# Altium schematic sheet LED.SchDoc
size A
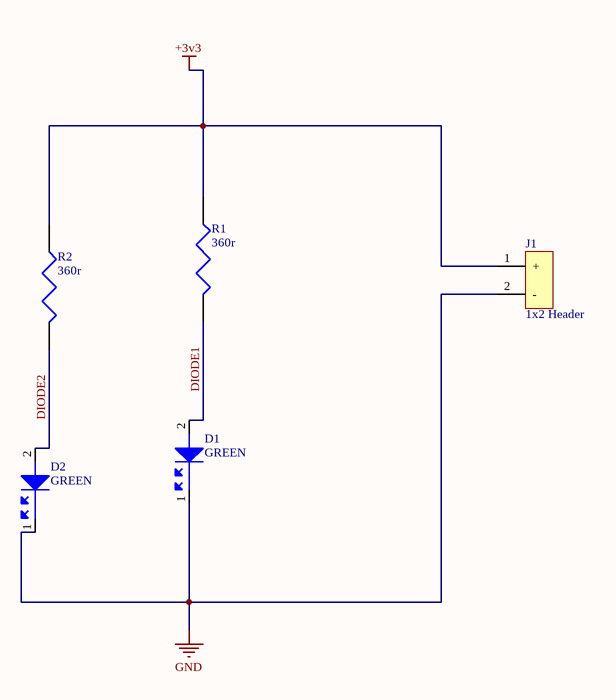
[diagram p0: LED.SchDoc]

## Parts
D1  GREEN  [LED0603G]
D2  GREEN  [LED0603G]
J1  1x2 Header  [HDR1x2]
R1  360r  [R0805]
R2  360r  [R0805]

## Nets
+3v3: J1.1(+) R1.2 R2.2
GND: D1.1 D2.1 J1.2(-)
DIODE1: D1.2 R1.1
DIODE2: D2.2 R2.1

## Library data of the parts
D1 D2 = LNJ337W83RA: LED GREEN ESS II SMD; Manufacturer 1: Panasonic SSG; Color: Green,Yellow; Luminous Intensity: 7.5mcd; Forward Voltage: 1.95V; Wavelength: 572nm; Forward Current: 20mA; Test Current: 5mA; Lens Style: Rectangular; Number of LEDs: 1; Max Power Dissipation: 55mW; Reverse Voltage: 4V; Supplier 1: RSComponents; Supplier Part Number 1: 1683745; Manufacturer Part Number 1: LNJ337W83RA; Stock 1: 0; RoHS: Yes; Mount: Surface Mount; Case/Package: 0603; Number of Pins: 2; Case Code (Metric): 1608; Case Code (Imperial): 0603; Min Operating Temperature: -30°C; Max Operating Temperature: 85°C; Package Quantity: 1; Packaging: Tape and Reel; Illumination Color: Green; Dominant Wavelength: 572nm; Length: 1.6mm; Height: 0.2mm; Width: 0.8mm; REACH SVHC: Yes; Lead Free: Lead Free; ComponentLink1URL: https://datasheet.ciiva.com/6868/lnj337w83ra-aek-6868817.pdf?src-supplier=Newark; ComponentLink1Description: https://datasheet.ciiva.com/6868/lnj337w83ra-aek-6868817.pdf?src-supplier=Newark; ComponentLink2URL: https://datasheet.ciiva.com/4690/lnj337w83ra-aek-226051-4690026.pdf?src-supplier=Mouser; ComponentLink2Description: https://datasheet.ciiva.com/4690/lnj337w83ra-aek-226051-4690026.pdf?src-supplier=Mouser; ComponentLink3URL: https://datasheet.ciiva.com/11775/0900766b80f0a8bb-11775418.pdf?src-supplier=RSComponents; ComponentLink3Description: https://datasheet.ciiva.com/11775/0900766b80f0a8bb-11775418.pdf?src-supplier=RSComponents; Category: Optoelectronics
J1 = 22-29-2021: Conn Wire to Board HDR 2 POS 2.54mm Solder ST Thru-Hole Bag; Manufacturer 1: Molex; Number of Positions: 2; Connector Type: Header,Male Pin; Gender: Male; Voltage Rating (DC): 250V; Contact Post Length: 0.14inch; Glow Wire Compliant: Non-compliant; Supplier 1: Digi-Key; Manufacturer Part Number 1: 22-29-2021; Stock 1: 25209; Pricing 1: 1=0.48000, 10=0.45200, 100=0.31630, 500=0.27112, 1000=0.22593, 5000=0.19365, 10000=0.18074 (USD); RoHS: Yes; Mount: Through Hole; Color: White; Contact Plating: Gold; Contact Material: Brass; Contact Shape: Square; Insulation Material: Nylon; Insulation Color: Natural; Max Operating Temperature: 80°C; Number of Rows: 1; Packaging: Bag; Termination: Solder; Fastening Type: Friction; Contact Mating Length: 0.295inch; Insulation Height: 0.461inch; Lead Free: Lead Free; Halogen Free: Low Halogen; Flammability Rating: UL94 V-0; ComponentLink1URL: https://datasheet.ciiva.com/70131/022292021-sd-70131706.pdf?src-supplier=Digi-Key; ComponentLink1Description: https://datasheet.ciiva.com/70131/022292021-sd-70131706.pdf?src-supplier=Digi-Key; Supplier Part Number 1: WM2744-ND; Category: Connectors
R1 R2 = CRCW0805360RFKEA: RES SMD 360 OHM 1% 1/8W 0805; Manufacturer 1: Vishay; Temperature Coefficient: 100ppm/°C; Max Power Dissipation: 125mW; Voltage Rating (DC): 150V; Supplier 1: Digi-Key; Supplier Part Number 1: 541-360CCT-ND; Manufacturer Part Number 1: CRCW0805360RFKEA; Stock 1: 17529; Pricing 1: 1=0.10000, 10=0.06600, 100=0.02670, 1000=0.01199, 2500=0.01041 (USD); RoHS: Yes; Case/Package: 0805; Number of Pins: 2; Weight: 0.000194oz; Case Code (Metric): 2012; Case Code (Imperial): 0805; Contact Plating: Tin; Min Operating Temperature: -55°C; Max Operating Temperature: 155°C; Resistance: 360R; Tolerance: 1%; Packaging: Tape and Reel; Composition: Thick Film; Package Quantity: 10; Number of Terminations: 2; Features: Automotive AEC-Q200; Power Rating: 125mW; Voltage Rating: 150V; Termination: SMD/SMT; Military Standard: Not; Length: 2mm; Height: 0.45mm; Width: 0.049inch; Depth: 1.25mm; Radiation Hardening: No; Lead Free: Lead Free; REACH SVHC: Unknown; ComponentLink1URL: https://datasheet.ciiva.com/11812/0900766b80d98b26-11812609.pdf?src-supplier=RSComponents; ComponentLink1Description: https://datasheet.ciiva.com/11812/0900766b80d98b26-11812609.pdf?src-supplier=RSComponents; ComponentLink2URL: https://datasheet.ciiva.com/7881/1697337-7881957.pdf?src-supplier=Element14; ComponentLink2Description: https://datasheet.ciiva.com/7881/1697337-7881957.pdf?src-supplier=Element14; ComponentLink3URL: https://datasheet.ciiva.com/7881/1697337-7881958.pdf?src-supplier=Element14; ComponentLink3Description: https://datasheet.ciiva.com/7881/1697337-7881958.pdf?src-supplier=Element14; ComponentLink4URL: https://datasheet.ciiva.com/8942/dcrcwe3-8942598.pdf?src-supplier=Avnet; ComponentLink4Description: https://datasheet.ciiva.com/8942/dcrcwe3-8942598.pdf?src-supplier=Avnet; ComponentLink5URL: https://datasheet.ciiva.com/22674/1847332-22674713.pdf?src-supplier=Element14; ComponentLink5Description: https://datasheet.ciiva.com/22674/1847332-22674713.pdf?src-supplier=Element14; ComponentLink6URL: https://datasheet.ciiva.com/2467/dcrcwe3-2467773.pdf?src-supplier=Digi-Key; ComponentLink6Description: https://datasheet.ciiva.com/2467/dcrcwe3-2467773.pdf?src-supplier=Digi-Key; ComponentLink7URL: https://datasheet.ciiva.com/2467/dcrcwe3-2467774.pdf?src-supplier=Digi-Key; ComponentLink7Description: https://datasheet.ciiva.com/2467/dcrcwe3-2467774.pdf?src-supplier=Digi-Key; ComponentLink8URL: https://datasheet.ciiva.com/5543/dcrcwe3-109170-5543710.pdf?src-supplier=Mouser; ComponentLink8Description: https://datasheet.ciiva.com/5543/dcrcwe3-109170-5543710.pdf?src-supplier=Mouser; ComponentLink9URL: https://datasheet.ciiva.com/2467/dcrcwe3-2467775.pdf?src-supplier=Digi-Key; ComponentLink9Description: https://datasheet.ciiva.com/2467/dcrcwe3-2467775.pdf?src-supplier=Digi-Key; Category: Resistors